# EAGLE design IOTAP (EAGLE 9.6.2)

## Sheet 1 of 3
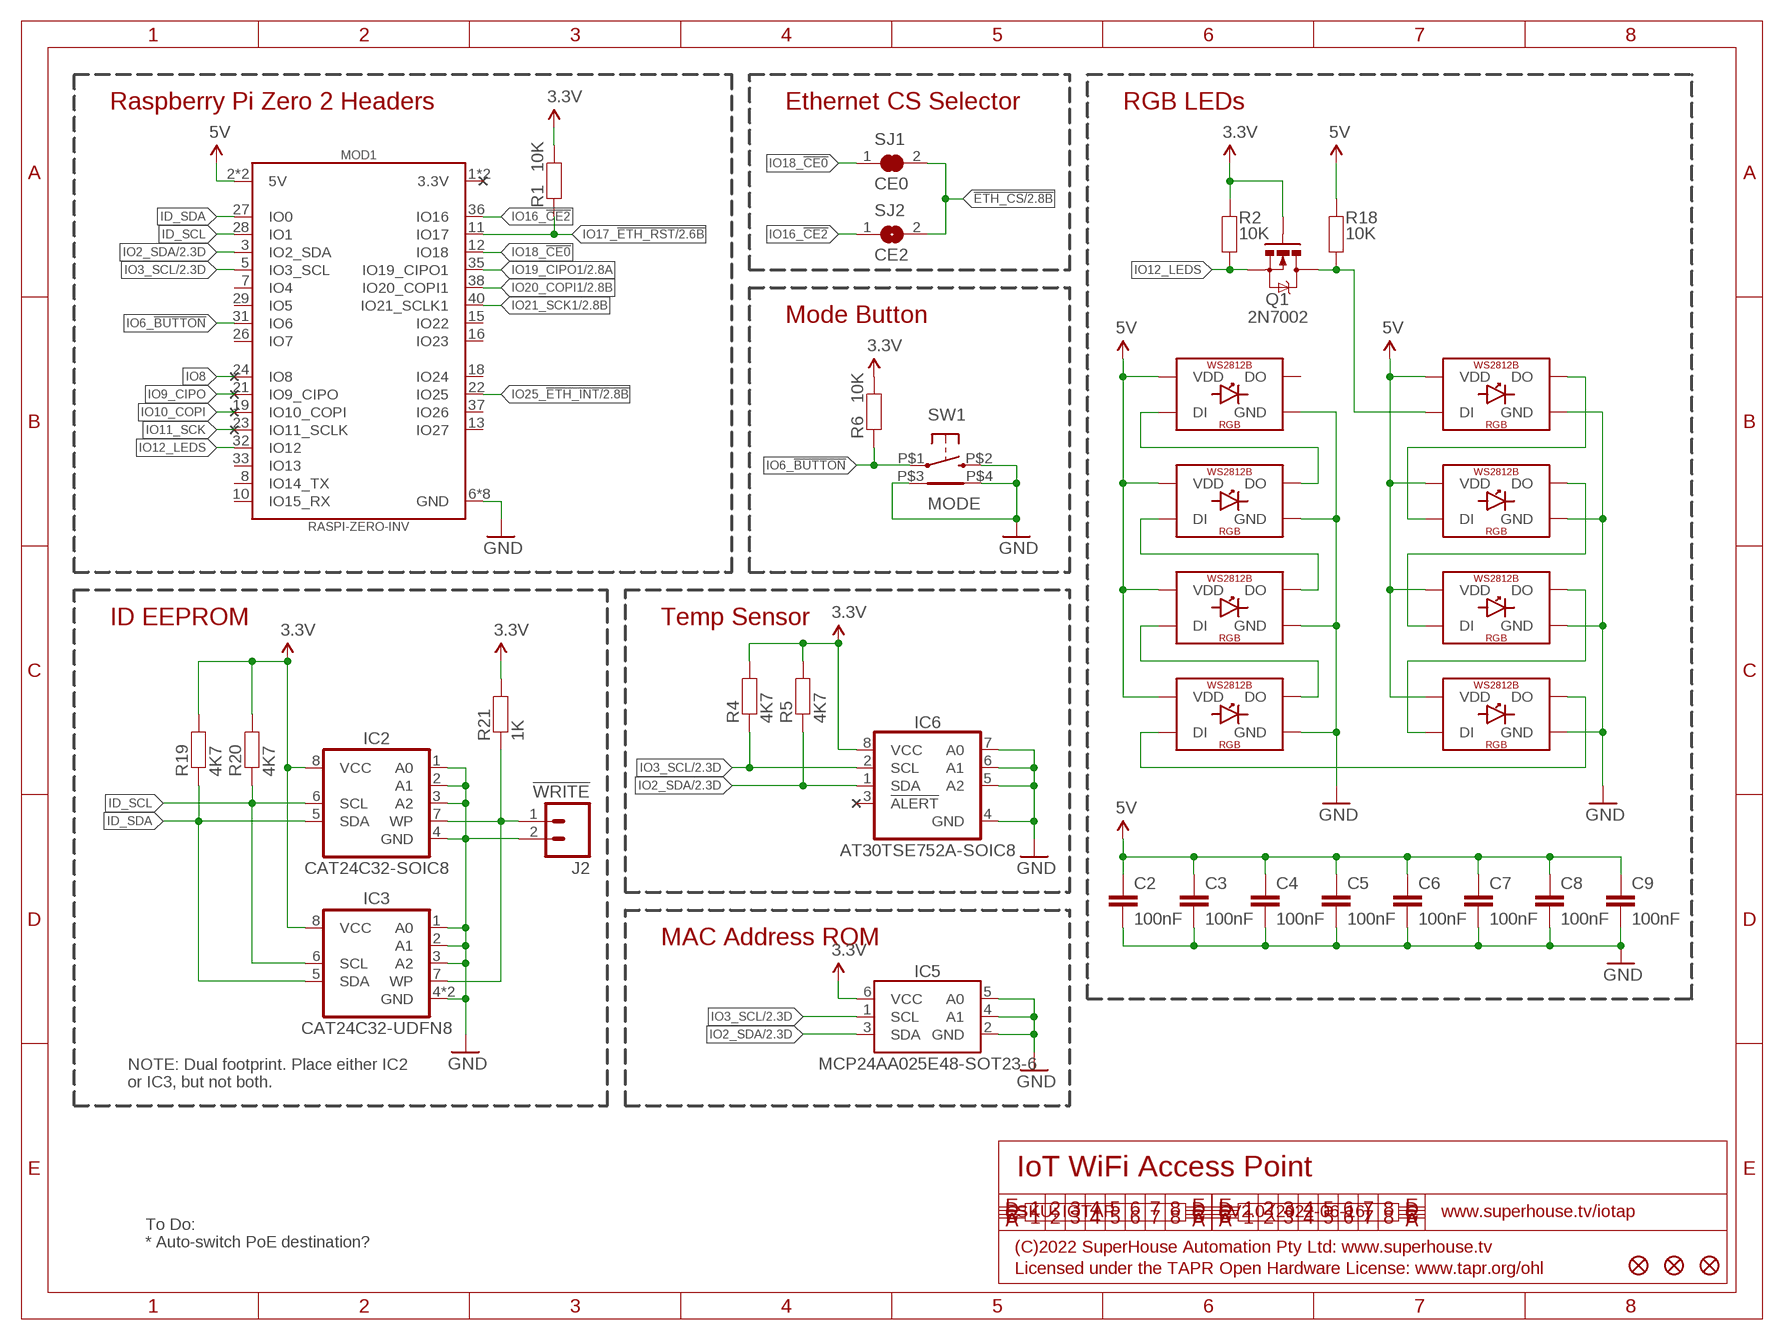
[diagram p0: schematic, sheet 1]

### Parts
C2  100nF  CAP0603  [C0603]
C3  100nF  CAP0603  [C0603]
C4  100nF  CAP0603  [C0603]
C5  100nF  CAP0603  [C0603]
C6  100nF  CAP0603  [C0603]
C7  100nF  CAP0603  [C0603]
C8  100nF  CAP0603  [C0603]
C9  100nF  CAP0603  [C0603]
FID1  FIDUCIAL1X2.5  [FIDUCIAL-1X2.5]
FID2  FIDUCIAL1X2.5  [FIDUCIAL-1X2.5]
FID3  FIDUCIAL1X2.5  [FIDUCIAL-1X2.5]
IC2  CAT24C32-SOIC8  [SOIC8]
IC3  CAT24C32-UDFN8  [UDFN8]
IC5  MCP24AA025E48-SOT23-6  [SOT23-6]
IC6  AT30TSE752A-SOIC8  [SOIC8]
J2  !WRITE  M02-PLAIN  [1X02]
LED1  WS2812B5050  [WS2812B]
LED2  WS2812B5050  [WS2812B]
LED3  WS2812B5050  [WS2812B]
LED4  WS2812B5050  [WS2812B]
LED5  WS2812B5050  [WS2812B]
LED6  WS2812B5050  [WS2812B]
LED7  WS2812B5050  [WS2812B]
LED8  WS2812B5050  [WS2812B]
MOD1  RASPI-ZERO-INV  [RPI-ZERO-INV]
Q1  2N7002  MOSFET-NCHANNEL-233  [SOT23-3]
R1  10K  RESISTOR0603  [R0603]
R2  10K  RESISTOR0603  [R0603]
R4  4K7  RESISTOR0603  [R0603]
R5  4K7  RESISTOR0603  [R0603]
R6  10K  RESISTOR0603  [R0603]
R18  10K  RESISTOR0603  [R0603]
R19  4K7  RESISTOR0603  [R0603]
R20  4K7  RESISTOR0603  [R0603]
R21  1K  RESISTOR0603  [R0603]
SJ1  CE0  SJC-NORMAL  [SJC]
SJ2  CE2  SJ-NORMAL  [SJ]
SW1  MODE  TAC-SWITCH-2PIN-GND-FSMMSHPTR  [TC-120V]

### Nets
3.3V: IC2.8(VCC) IC3.8(VCC) IC5.6(VCC) IC6.8(VCC) Q1.1(G) R1.2 R2.2 R4.2 R5.2 R6.2 R19.2 R20.2 R21.2 ; also sheet 2,3
5V: C2.1 C3.1 C4.1 C5.1 C6.1 C7.1 C8.1 C9.1 LED1.1-VDD(VDD) LED2.1-VDD(VDD) LED3.1-VDD(VDD) LED4.1-VDD(VDD) LED5.1-VDD(VDD) LED6.1-VDD(VDD) LED7.1-VDD(VDD) LED8.1-VDD(VDD) MOD1.2(5V) MOD1.4(5V) R18.2 ; also sheet 3
!ETH_CS: SJ1.2 SJ2.2 ; also sheet 2
GND: C2.2 C3.2 C4.2 C5.2 C6.2 C7.2 C8.2 C9.2 IC2.1(A0) IC2.2(A1) IC2.3(A2) IC2.4(GND) IC3.1(A0) IC3.2(A1) IC3.3(A2) IC3.4(GND) IC3.PAD(GND) IC5.2(GND) IC5.4(A1) IC5.5(A0) IC6.4(GND) IC6.5(A2) IC6.6(A1) IC6.7(A0) J2.2 LED1.3-GND(GND) LED2.3-GND(GND) LED3.3-GND(GND) LED4.3-GND(GND) LED5.3-GND(GND) LED6.3-GND(GND) LED7.3-GND(GND) LED8.3-GND(GND) MOD1.6(GND) MOD1.9(GND) MOD1.14(GND) MOD1.20(GND) MOD1.25(GND) MOD1.30(GND) MOD1.34(GND) MOD1.39(GND) SW1.P$2 SW1.P$3(TAB1) SW1.P$4(TAB2) ; also sheet 2,3
ID_SCL: IC2.6(SCL) IC3.6(SCL) MOD1.28(IO1) R20.1
ID_SDA: IC2.5(SDA) IC3.5(SDA) MOD1.27(IO0) R19.1
IO2_SDA: IC5.3(SDA) IC6.1(SDA) MOD1.3(IO2_SDA) R5.1 ; also sheet 2
IO3_SCL: IC5.1(SCL) IC6.2(SCL) MOD1.5(IO3_SCL) R4.1 ; also sheet 2
IO6_!BUTTON: MOD1.31(IO6) R6.1 SW1.P$1
IO8: MOD1.24(IO8)
IO9_CIPO: MOD1.21(IO9_CIPO)
IO10_COPI: MOD1.19(IO10_COPI)
IO11_SCK: MOD1.23(IO11_SCLK)
IO12_LEDS: MOD1.32(IO12) Q1.2(S) R2.1
IO16_!CE2: MOD1.36(IO16) SJ2.1
IO17_!ETH_RST: MOD1.11(IO17) R1.1 ; also sheet 2
IO18_!CE0: MOD1.12(IO18) SJ1.1
IO19_CIPO1: MOD1.35(IO19_CIPO1) ; also sheet 2
IO20_COPI1: MOD1.38(IO20_COPI1) ; also sheet 2
IO21_SCK1: MOD1.40(IO21_SCLK1) ; also sheet 2
IO25_!ETH_INT: MOD1.22(IO25) ; also sheet 2
LEDS: LED1.4-DIN(DI) Q1.3(D) R18.1
N$5: IC2.7(WP) IC3.7(WP) J2.1 R21.1
N$9: LED4.2-DOUT(DO) LED5.4-DIN(DI)
N$10: LED5.2-DOUT(DO) LED6.4-DIN(DI)
N$11: LED6.2-DOUT(DO) LED7.4-DIN(DI)
N$12: LED7.2-DOUT(DO) LED8.4-DIN(DI)
N$13: LED1.2-DOUT(DO) LED2.4-DIN(DI)
N$14: LED2.2-DOUT(DO) LED3.4-DIN(DI)
N$15: LED3.2-DOUT(DO) LED4.4-DIN(DI)
Unconnected: IC6.3(!ALERT) LED8.2-DOUT(DO) MOD1.1(3.3V) MOD1.7(IO4) MOD1.8(IO14_TX) MOD1.10(IO15_RX) MOD1.13(IO27) MOD1.15(IO22) MOD1.16(IO23) MOD1.17(3.3V) MOD1.18(IO24) MOD1.26(IO7) MOD1.29(IO5) MOD1.33(IO13) MOD1.37(IO26)

### Notes on the sheet
- Raspberry Pi Zero 2 Headers | Ethernet CS Selector | RGB LEDs
- Mode Button
- ID EEPROM | Temp Sensor
- MAC Address ROM
- NOTE: Dual footprint. Place either IC2
  or IC3, but not both.
- IoT WiFi Access Point
- SKU: IOTAP | V2.0 (2022-06-16) | www.superhouse.tv/iotap
- To Do:
  * Auto-switch PoE destination?
- (C)2022 SuperHouse Automation Pty Ltd: www.superhouse.tv
- Licensed under the TAPR Open Hardware License: www.tapr.org/ohl

## Sheet 2 of 3
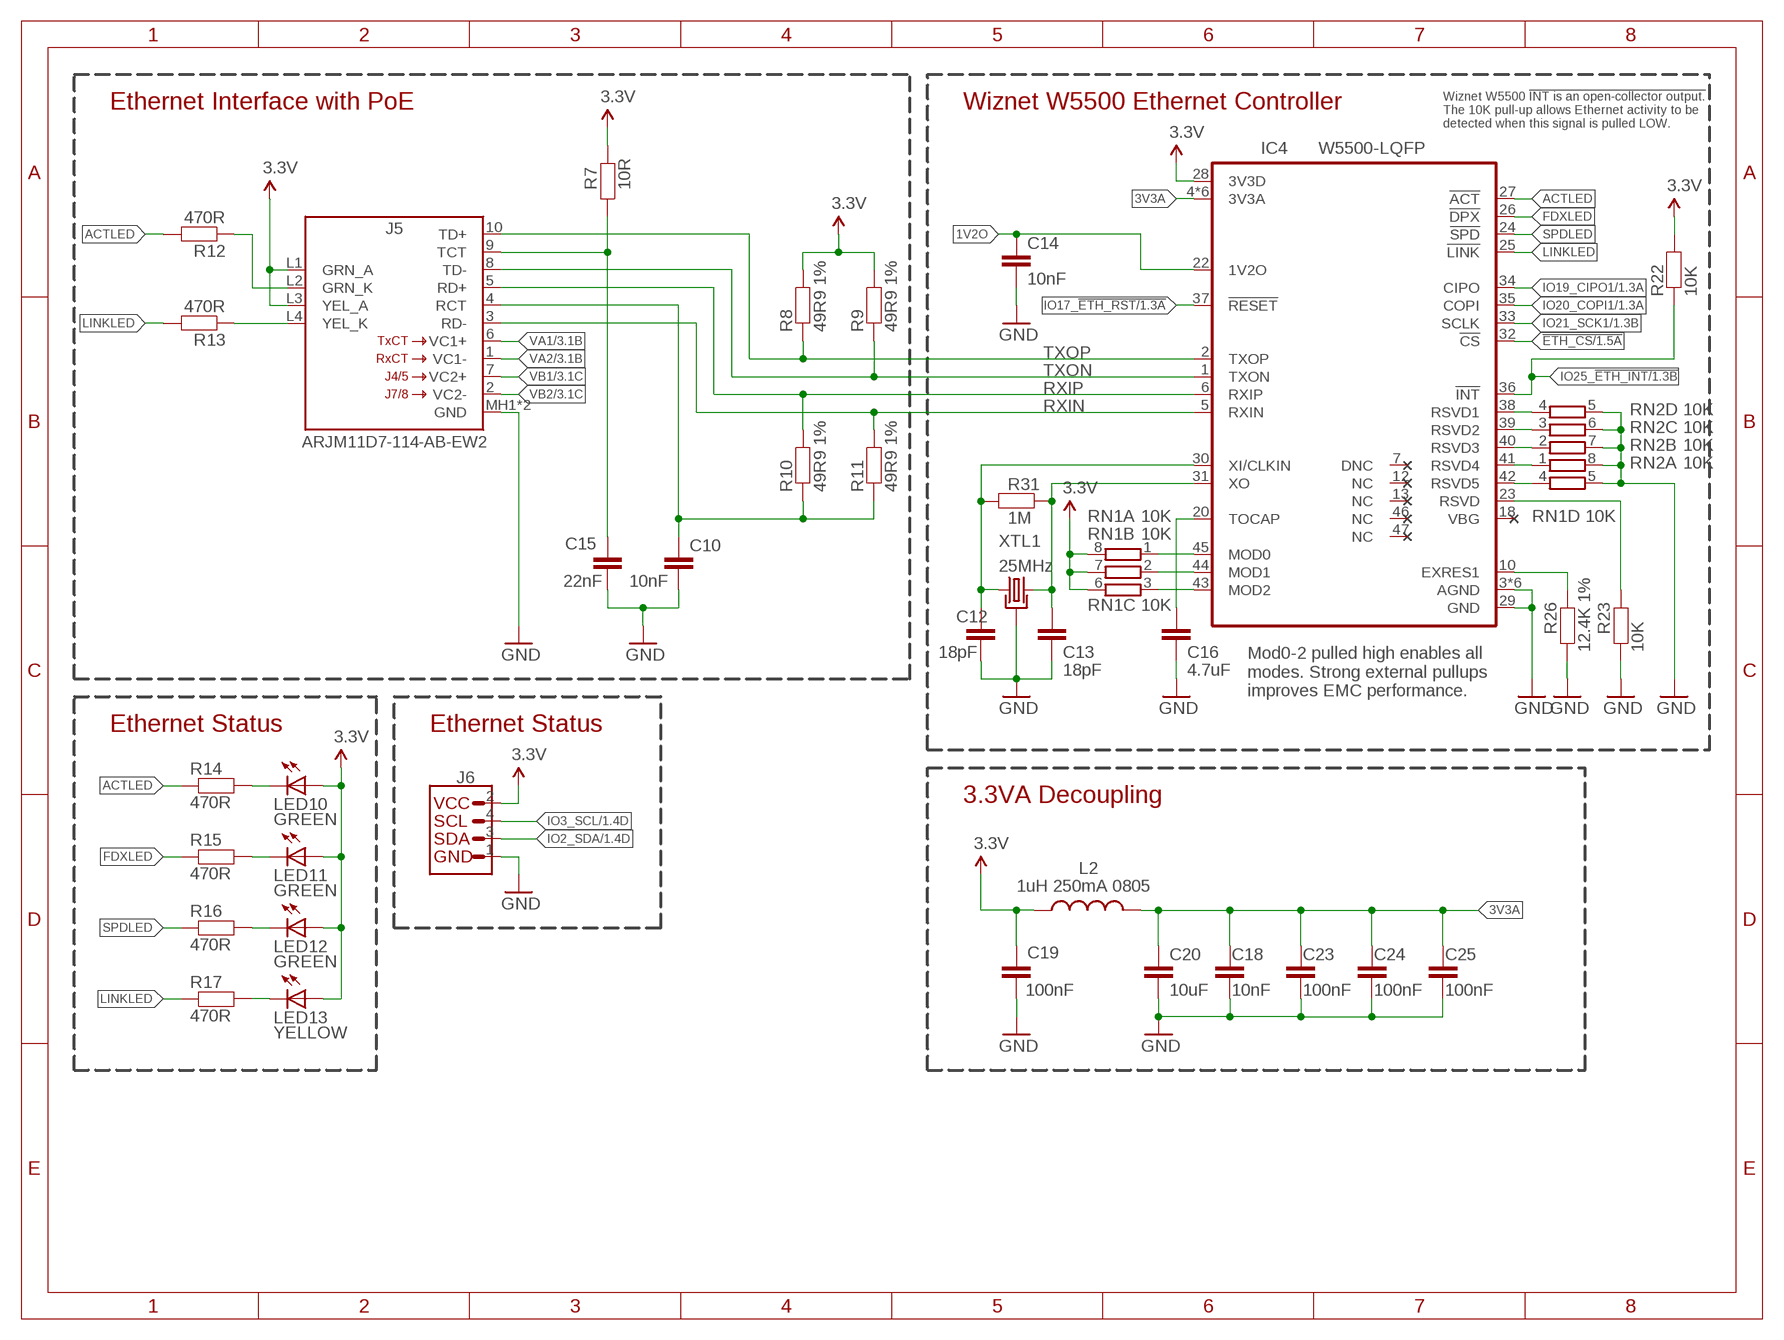
[diagram p1: schematic, sheet 2]

### Parts
C10  10nF  CAP0603  [C0603]
C12  18pF  CAP0603  [C0603]
C13  18pF  CAP0603  [C0603]
C14  10nF  CAP0603  [C0603]
C15  22nF  CAP0603  [C0603]
C16  4.7uF  CAP0603  [C0603]
C18  10nF  CAP0603  [C0603]
C19  100nF  CAP0603  [C0603]
C20  10uF  CAP0805  [C0805]
C23  100nF  CAP0603  [C0603]
C24  100nF  CAP0603  [C0603]
C25  100nF  CAP0603  [C0603]
IC4  W5500-LQFP  [LQFP48]
J5  ARJM11D7-114-AB-EW2  [ARJM11D7114ABEW2]
J6  QWIICJS-1MM  [1X04_QWIIC_1MM_RA]
L2  1uH 250mA 0805  L-USL2012C  [L2012C]
LED10  GREEN  LED0603  [LED-0603]
LED11  GREEN  LED0603  [LED-0603]
LED12  GREEN  LED0603  [LED-0603]
LED13  YELLOW  LED0603  [LED-0603]
R7  10R  RESISTOR0603  [R0603]
R8  49R9 1%  RESISTOR0603  [R0603]
R9  49R9 1%  RESISTOR0603  [R0603]
R10  49R9 1%  RESISTOR0603  [R0603]
R11  49R9 1%  RESISTOR0603  [R0603]
R12  470R  RESISTOR0603  [R0603]
R13  470R  RESISTOR0603  [R0603]
R14  470R  RESISTOR0603  [R0603]
R15  470R  RESISTOR0603  [R0603]
R16  470R  RESISTOR0603  [R0603]
R17  470R  RESISTOR0603  [R0603]
R22  10K  RESISTOR0603  [R0603]
R23  10K  RESISTOR0603  [R0603]
R26  12.4K 1%  RESISTOR0603  [R0603]
R31  1M  RESISTOR0603  [R0603]
RN1  10K  4R-NCAY16  [CAY16]
RN2  10K  4R-NCAY16  [CAY16]
XTL1  25MHz  CRYSTAL-GND3X2  [CRYSTAL-SMD-3X2]

### Nets
1V2O: C14.1 IC4.22(1V2O)
3.3V: C19.1 IC4.28(3V3D) J5.L1(GRN_A) J5.L3(YEL_A) J6.2 L2.1 LED10.A LED11.A LED12.A LED13.A R7.1 R8.2 R9.2 R22.2 RN1.6 RN1.7 RN1.8 ; also sheet 1,3
3V3A: C18.1 C20.1 C23.1 C24.1 C25.1 IC4.4(3V3A) IC4.8(3V3A) IC4.11(3V3A) IC4.15(3V3A) IC4.17(3V3A) IC4.21(3V3A) L2.2
!ETH_CS: IC4.32(!CS) ; also sheet 1
ACTLED: IC4.27(!ACT) R12.2 R14.1
FDXLED: IC4.26(!DPX) R15.1
GND: C10.2 C12.2 C13.2 C14.2 C15.2 C16.2 C18.2 C19.2 C20.2 C23.2 C24.2 C25.2 IC4.3(AGND) IC4.9(AGND) IC4.14(AGND) IC4.16(AGND) IC4.19(AGND) IC4.29(GND) IC4.48(AGND) J5.MH1(GND) J5.MH2(GND) J6.1 R23.2 R26.2 RN1.5 RN2.5 RN2.6 RN2.7 RN2.8 XTL1.2(GND) XTL1.4(GND) ; also sheet 1,3
IO2_SDA: J6.3 ; also sheet 1
IO3_SCL: J6.4 ; also sheet 1
IO17_!ETH_RST: IC4.37(!RESET) ; also sheet 1
IO19_CIPO1: IC4.34(CIPO) ; also sheet 1
IO20_COPI1: IC4.35(COPI) ; also sheet 1
IO21_SCK1: IC4.33(SCLK) ; also sheet 1
IO25_!ETH_INT: IC4.36(!INT) R22.1 ; also sheet 1
LINKLED: IC4.25(!LINK) R13.2 R17.1
N$3: J5.L4(YEL_K) R13.1
N$4: J5.L2(GRN_K) R12.1
N$18: C13.1 IC4.31(XO) R31.1 XTL1.3
N$20: C10.1 J5.4(RCT) R10.1 R11.1
N$26: LED12.C R16.2
N$27: C12.1 IC4.30(XI/CLKIN) R31.2 XTL1.1
N$28: LED13.C R17.2
N$31: C16.1 IC4.20(TOCAP)
N$32: C15.1 J5.9(TCT) R7.2
N$33: IC4.10(EXRES1) R26.1
N$34: IC4.23(RSVD) R23.1
N$36: IC4.45(MOD0) RN1.1
N$37: IC4.44(MOD1) RN1.2
N$38: IC4.43(MOD2) RN1.3
N$39: IC4.42(RSVD5) RN1.4
N$40: IC4.41(RSVD4) RN2.1
N$41: IC4.40(RSVD3) RN2.2
N$42: IC4.39(RSVD2) RN2.3
N$43: IC4.38(RSVD1) RN2.4
N$327: LED11.C R15.2
N$329: LED10.C R14.2
RXIN: IC4.5(RXIN) J5.3(RD-) R11.2
RXIP: IC4.6(RXIP) J5.5(RD+) R10.2
SPDLED: IC4.24(!SPD) R16.1
TXON: IC4.1(TXON) J5.8(TD-) R9.1
TXOP: IC4.2(TXOP) J5.10(TD+) R8.1
VA1: J5.6(VC1+) ; also sheet 3
VA2: J5.1(VC1-) ; also sheet 3
VB1: J5.7(VC2+) ; also sheet 3
VB2: J5.2(VC2-) ; also sheet 3
Unconnected: IC4.7(DNC) IC4.12(NC) IC4.13(NC) IC4.18(VBG) IC4.46(NC) IC4.47(NC)

### Notes on the sheet
- Ethernet Interface with PoE | Wiznet W5500 Ethernet Controller
- Wiznet W5500 !INT is an open-collector output.
  The 10K pull-up allows Ethernet activity to be
  detected when this signal is pulled LOW.
- Mod0-2 pulled high enables all
  modes. Strong external pullups
  improves EMC performance.
- Ethernet Status | Ethernet Status
- 3.3VA Decoupling

## Sheet 3 of 3
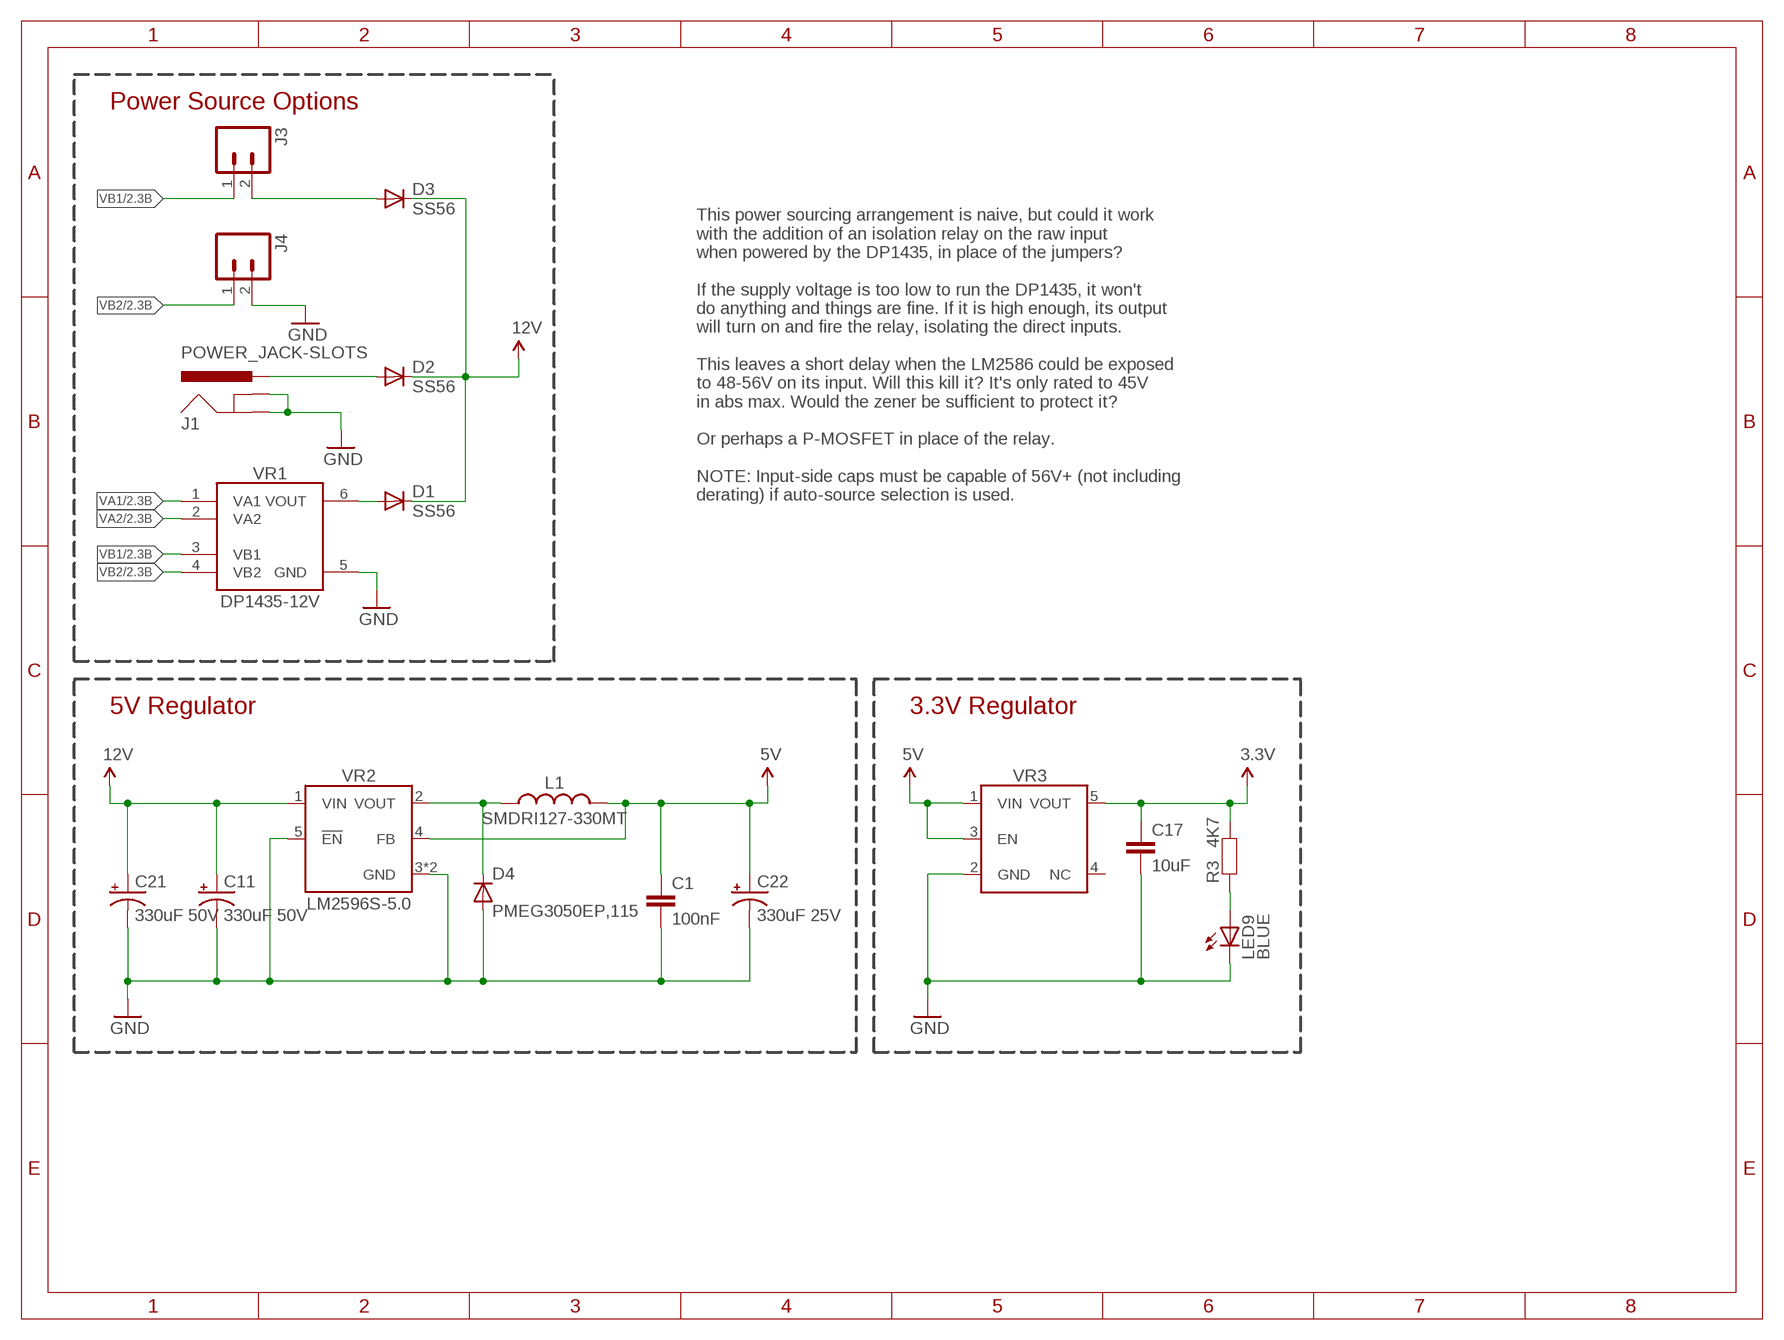
[diagram p2: schematic, sheet 3]

### Parts
C1  100nF  CAP0603  [C0603]
C11  330uF 50V  CAP_POLG  [PANASONIC_G]
C17  10uF  CAP0805  [C0805]
C21  330uF 50V  CAP_POLG  [PANASONIC_G]
C22  330uF 25V  CAP_POLG  [PANASONIC_G]
D1  SS56  DIODESMA  [SMA-DIODE]
D2  SS56  DIODESMA  [SMA-DIODE]
D3  SS56  DIODESMA  [SMA-DIODE]
D4  PMEG3050EP,115  DIODE-SOD128  [SOD-128]
J1  POWER_JACK-SLOTS  [POWER_JACK_SLOTS]
J3  M02-PIN-RA  [1X02-P-RA]
J4  M02-PIN-RA  [1X02-P-RA]
L1  SMDRI127-330MT  INDUCTORCDRH127  [INDPM120120X800N]
LED9  BLUE  LED0603  [LED-0603]
R3  4K7  RESISTOR0603  [R0603]
VR1  DP1435-12V  DP1435-SIL  [DP1435]
VR2  LM2596S-5.0  LM2596S-XX  [TO170P1435X465-6N]
VR3  AP2112KSOT25  [SOT23-5]

### Nets
3.3V: C17.1 R3.2 VR3.5(VOUT) ; also sheet 1,2
5V: C1.1 C22.+ L1.2 VR2.4(FB) VR3.1(VIN) VR3.3(EN) ; also sheet 1
12V: C11.+ C21.+ D1.C D2.C D3.C VR2.1(VIN)
GND: C1.2 C11.- C17.2 C21.- C22.- D4.2(A) J1.GND J1.GNDBREAK J4.2 LED9.C VR1.5(GND) VR2.3(GND) VR2.5(!EN) VR2.6(GND) VR3.2(GND) ; also sheet 1,2
N$1: D3.A J3.2
N$2: D4.1(C) L1.1 VR2.2(VOUT)
N$16: LED9.A R3.1
N$17: D2.A J1.PWR
N$19: D1.A VR1.6(VOUT)
VA1: VR1.1(VA1) ; also sheet 2
VA2: VR1.2(VA2) ; also sheet 2
VB1: J3.1 VR1.3(VB1) ; also sheet 2
VB2: J4.1 VR1.4(VB2) ; also sheet 2
Unconnected: VR3.4(NC)

### Notes on the sheet
- Power Source Options
- This power sourcing arrangement is naive, but could it work
  with the addition of an isolation relay on the raw input
  when powered by the DP1435, in place of the jumpers?
  
  If the supply voltage is too low to run the DP1435, it won't
  do anything and things are fine. If it is high enough, its output
  will turn on and fire the relay, isolating the direct inputs.
  
  This leaves a short delay when the LM2586 could be exposed
  to 48-56V on its input. Will this kill it? It's only rated to 45V
  in abs max. Would the zener be sufficient to protect it?
  
  Or perhaps a P-MOSFET in place of the relay.
  
  NOTE: Input-side caps must be capable of 56V+ (not including
  derating) if auto-source selection is used.
- 5V Regulator | 3.3V Regulator

## Library data of the parts
C1-C10 C12-C20 C23-C25 = SuperHouse-Capacitors:CAP: Capacitor Standard ceramic capacitor
C11 C21 C22 = SuperHouse-Capacitors:CAP_POL: Capacitor Polarized These are standard SMD and PTH capacitors. Normally 10uF, 47uF, and 100uF in electrolytic and tantalum varieties. Always verify the external diameter of the through hole cap, it varies with capacity, voltage, and manufacturer. The EIA devices should be standard.
D1-D4 = SuperHouse-Diodes:DIODE: Diode Standard reverse protection diodes and small signal diodes. SMA package can handle up to about 1A. SOD-323 can handle about 200mA.
FID1-FID3 = SuperHouse-Symbols:FIDUCIAL: Fiducial Alignment Points Various fiducial points for machine vision alignment.
IC2 IC3 = SuperHouse-ICs:CAT24C32
IC4 = SuperHouse-ICs:W5500
IC5 = SuperHouse-ICs:MCP24AA025E48: MAC address ROM with I2C interface
IC6 = SuperHouse-Sensors:AT30TSE752A: AT30TSE752A I2C temperature sensor with EEPROM
J1 = SuperHouse-Connectors:POWER_JACK: Power Jack This is the standard 5.5mm barrel jack for power. The PTH is the most common, proven, reliable, footprint. All others are experimental. The Slot footprint only works if the mill layer is transmitted to the PCB fab house so be warned. Spark Fun Electronics SKU : PRT-00119. Mating wall wart : TOL-00298 (and others)
J2-J4 = SuperHouse-Connectors:M02: 2-way header Standard 1x2 header, and screw terminal variations
J5 = SuperHouse-Connectors:ARJM11D7-114-AB-EW2: Modular Connectors / Ethernet Connectors Source: Datasheet; DESCRIPTION: Modular Connectors / Ethernet Connectors; HEIGHT: 13.6mm; MANUFACTURER_NAME: ABRACON; MANUFACTURER_PART_NUMBER: ARJM11D7-114-AB-EW2; MOUSER_PART_NUMBER: 815-RJM11D7114ABEW2; MOUSER_PRICE-STOCK: https://www.mouser.co.uk/ProductDetail/ABRACON/ARJM11D7-114-AB-EW2?qs=YCa%2FAAYMW02ICsJcHu%252BNJg%3D%3D
J6 = SuperHouse-Connectors:QWIIC: SparkFun I2C Standard Qwiic Connector An SMD 1mm pitch JST connector makes it easy and quick (get it? Qwiic?) to connect I2C devices to each other. The Qwiic system <http://www.sparkfun.com/qwiic> enables fast and solderless connection between popular platforms and various sensors and actuators.; PROD_ID: CONN-13694
L1 = SuperHouse-Inductors:INDUCTOR: INDUCTOR, American symbol
L2 = rcl:L-US: INDUCTOR, American symbol; SPICEPREFIX: L
LED1-LED8 = SuperHouse-LEDs:WS2812B: WS2812B addressable RGB LED
LED9-LED13 = SuperHouse-LEDs:LED: LEDs in various sizes including 5mm and 3mm PTH, and 0402, 0603, 0805, etc SMT
MOD1 = SuperHouse-Modules:RASPI
Q1 = SuperHouse-Transistors:MOSFET-NCHANNEL: N-channel MOSFET
R1-R23 R26 R31 = SuperHouse-Resistors:RESISTOR: Resistors in both surface-mount and through-hole versions.
RN1 RN2 = SuperHouse-Resistors:4R-N: Array Chip Resistor Source: RS Component / Phycomp
SJ1 = SuperHouse-Jumpers:SJC: Solder jumper. Normally closed: does not need solder to close. Can be opened by cutting the track.
SJ2 = SuperHouse-Jumpers:SJ: SMD solder jumper, normally-open. Add solder to close the connection.
SW1 = SuperHouse-Switches:TAC-SWITCH-2PIN-GND: Tactile switch (right angle) with 2 mounting tabs
VR1 = SuperHouse-Regulators:DP1435: SDAPO DP1435 12V PoE regulator
VR2 = SuperHouse-Regulators:LM2596S-XX: 4.5V to 40V, 3A Low Component Count Step-Down Regulator Source: Datasheet <http://www.ti.com/lit/ds/symlink/lm2596.pdf>
VR3 = SuperHouse-Regulators:AP2112K: AP2112K LDO linear voltage regulator
XTL1 = SuperHouse-Oscillators:CRYSTAL-GND: 3x2mm SMT crystal

## Net classes
0 default: width 0.152 mm, drill 0.241 mm, clearance 0.152 mm

## Board
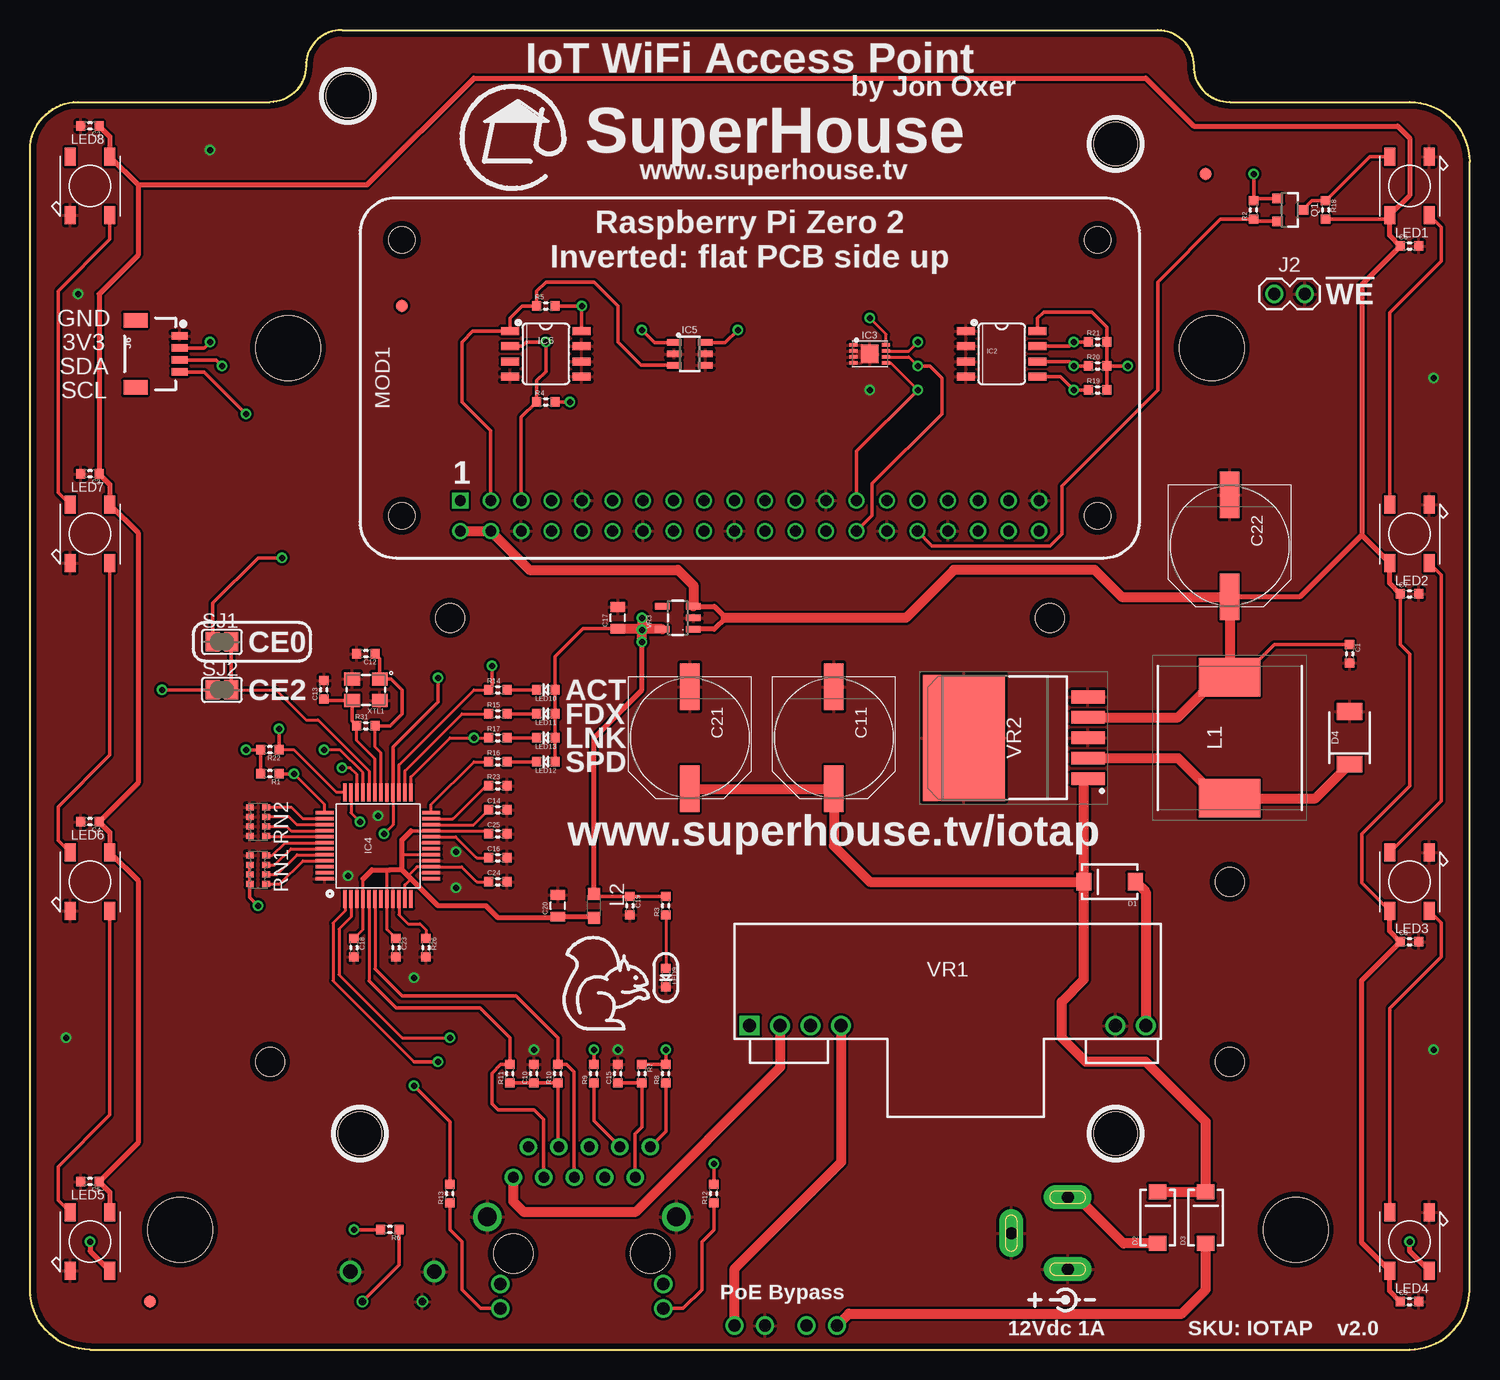
[diagram p3: board, top side]
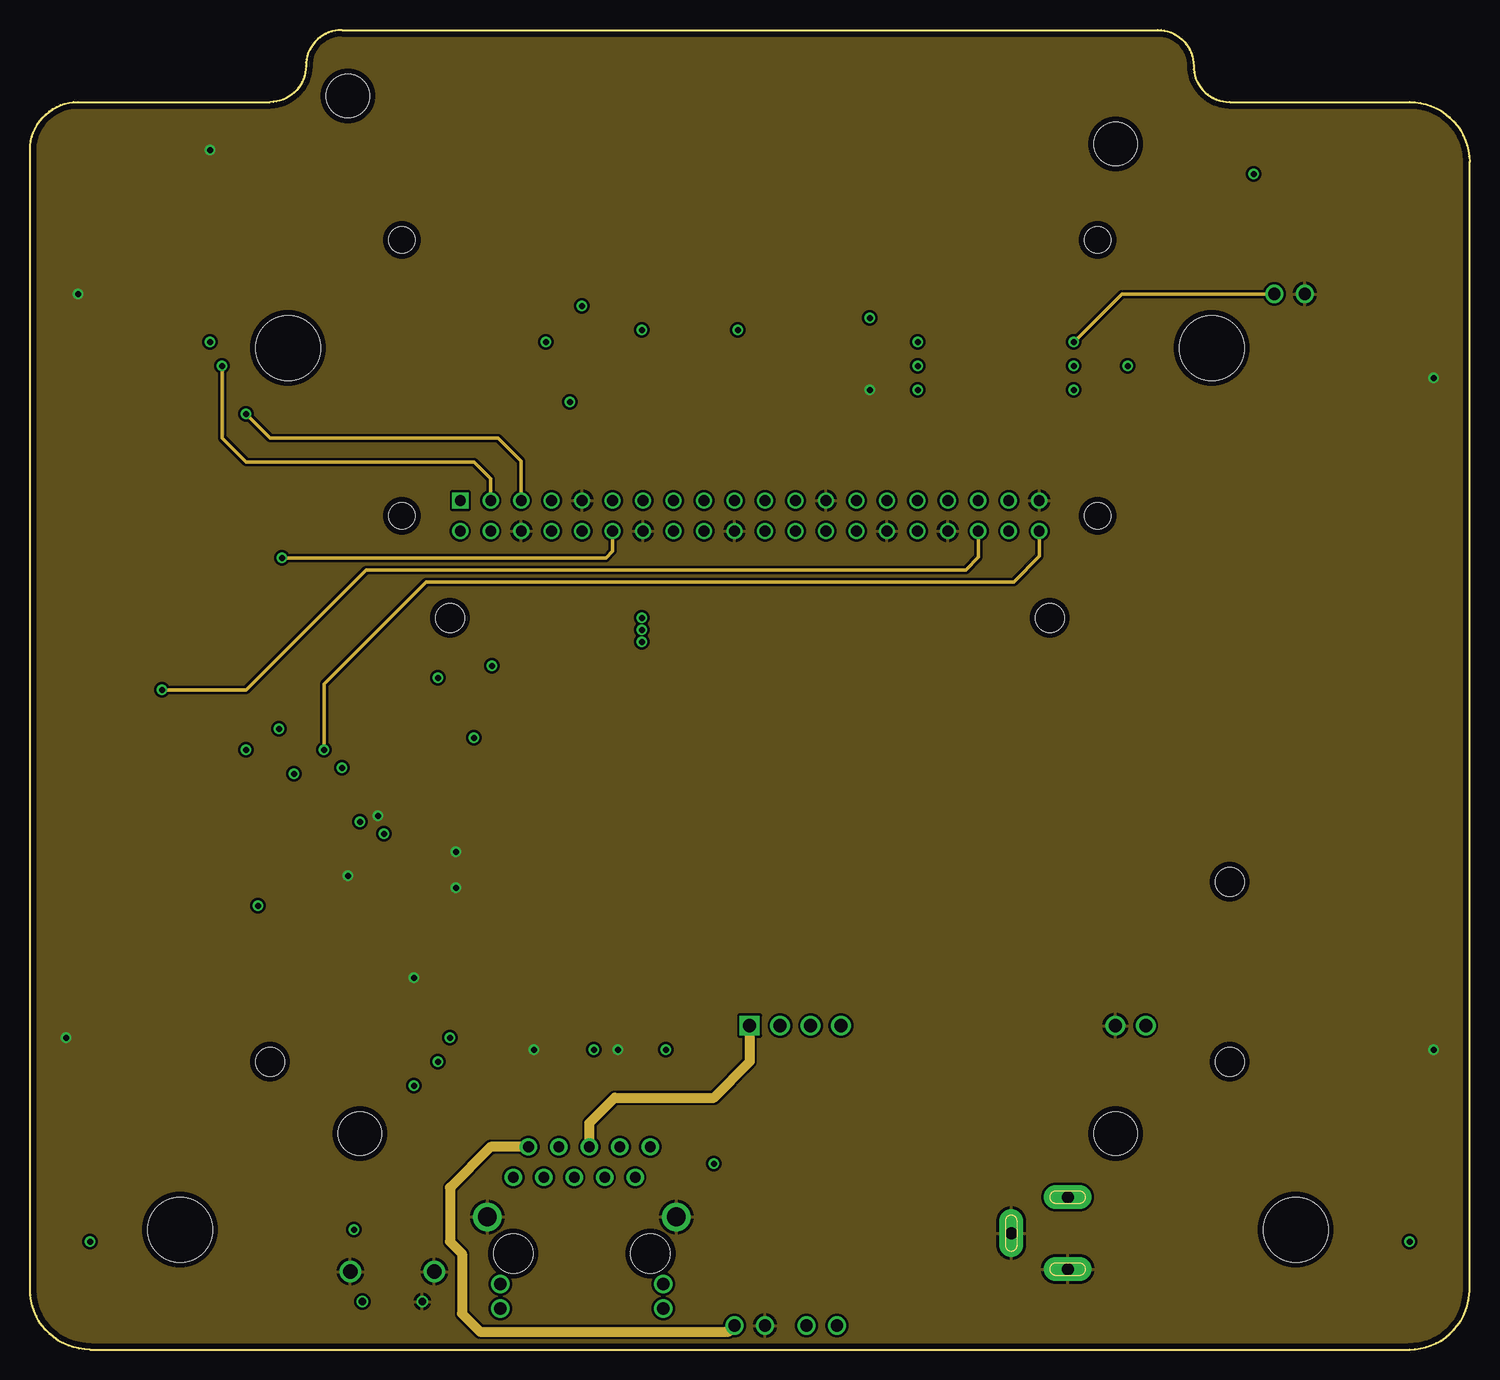
[diagram p4: board, inner layer Route2]
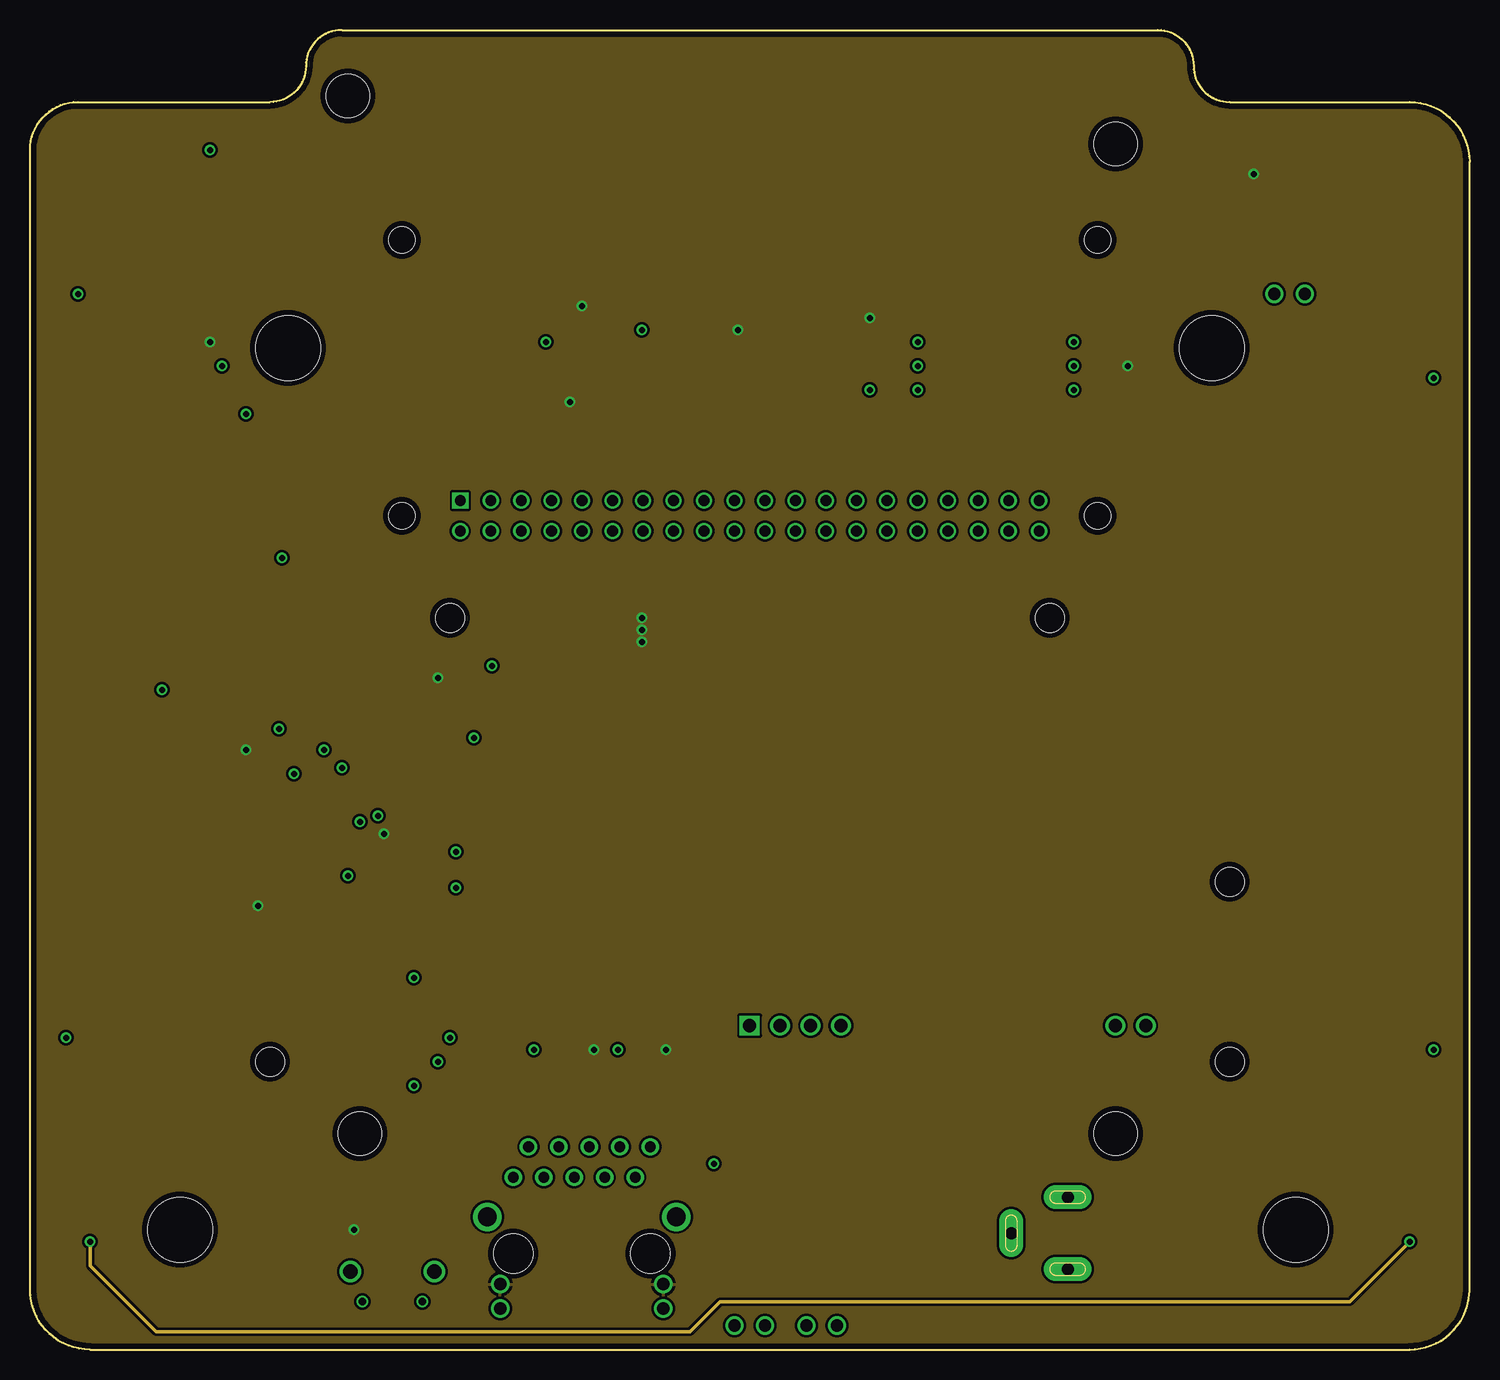
[diagram p5: board, inner layer Route15]
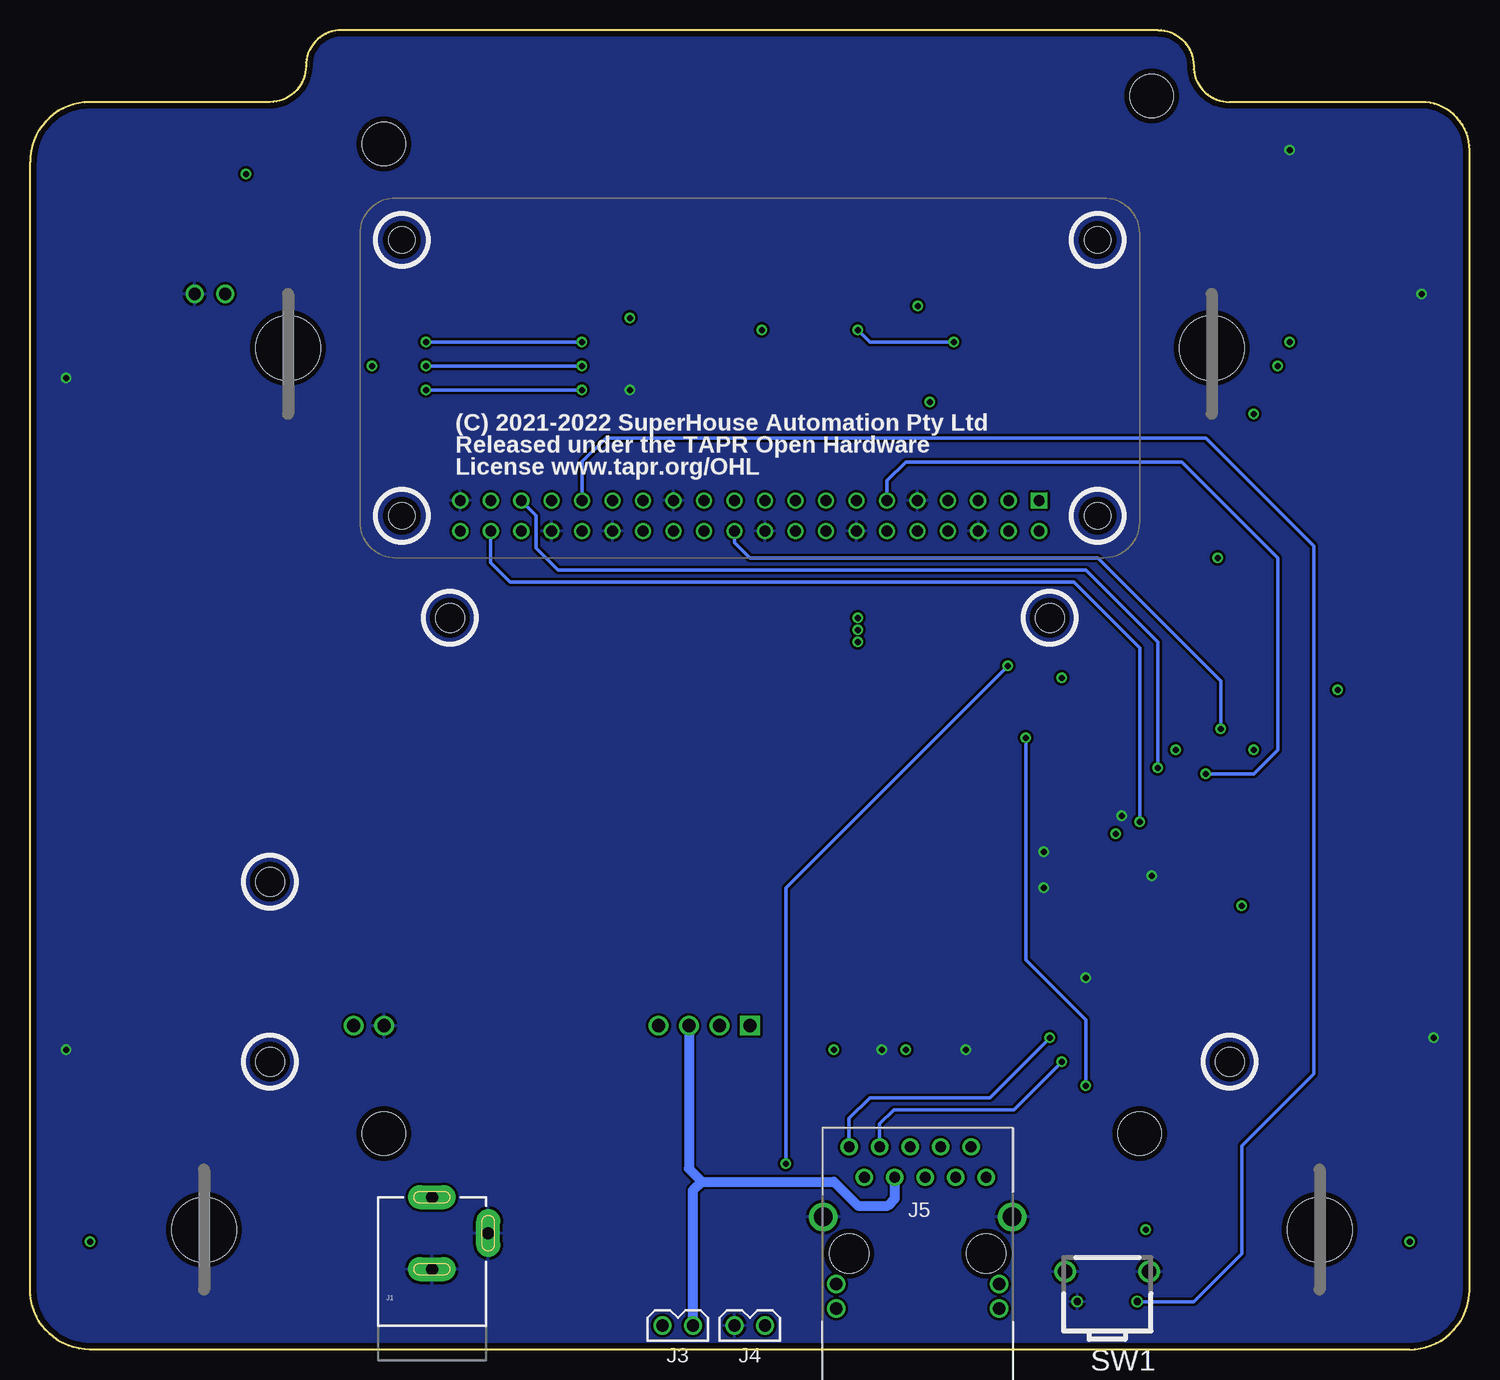
[diagram p6: board, bottom side, seen from below]

Size 120 x 110 mm. Coordinates in mm from the lower left corner, seen from the top.
Outline: 5,0 115,0 arc90 120,5 120,99 arc90 115,104 100,104 arc-90 97,107 arc90 94,110 26,110 arc90 23,107 arc-90 20,104 4,104 arc90 0,100 0,5 arc90 5,0
Copper layers (1+2*15+16): Top 0.035mm / dielectric 1.5mm / Route2 0.035mm / dielectric 0.15mm / Route15 0.035mm / dielectric 0.2mm / Bottom 0.035mm
Design rules "SuperHouse-Design-Rules *": minimum track width 10mil, minimum drill 24mil, track to track 8mil, track to pad 8mil, pad to pad 8mil, via to via 8mil, smd to smd 6mil, copper to edge 18mil, drill to drill 8mil, minimum pad ring 7mil, minimum via ring 8mil, stop-mask expansion 4mil, vias tented up to drill 0.5mm, thermal gap 10mil
Holes 5.4 mm at 105.5,10 12.5,10 21.5,83.5 98.5,83.5
Holes 3.6 mm at 27.5,18 90.5,18 26.5,104.5 90.5,100.5
Holes 2.4 mm at 85,61 35,61 100,39 100,24 20,24

### Footprints (pad centres in the part's own frame; a part is rotated, then mirrored left to right if it is on the bottom)
C0603 = smd 0.762 x 0.762: 1 -0.762,0; 2 0.762,0
PANASONIC_G = smd 3.9 x 1.6: + 4.25,0; - -4.25,0
C0805 = smd 0.8 x 1.2: 1 -0.9,0; 2 0.9,0
SMA-DIODE = smd 1.27 x 1.47: A -2.15,0; C 2.15,0
SOD-128 = smd 1.4 x 2.1: 1 -2.2,0; 2 2.2,0
FIDUCIAL-1X2.5 = smd 1 x 1: 1 0,0
SOIC8 = smd 1.524 x 0.66: 1 -2.973,1.905; 2 -2.973,0.635; 3 -2.973,-0.635; 4 -2.973,-1.905; 5 2.973,-1.905; 6 2.973,-0.635; 7 2.973,0.635; 8 2.973,1.905
UDFN8 = smd 0.68 x 0.3: 1 -1.36,0.75; 2 -1.36,0.25; 3 -1.36,-0.25; 4 -1.36,-0.75; 5 1.36,-0.75; 6 1.36,-0.25; 7 1.36,0.25; 8 1.36,0.75 | smd 1.45 x 1.56: PAD 0,0
LQFP48 = smd 1.5 x 0.3: 1 -4.45,2.75; 2 -4.45,2.25; 3 -4.45,1.75; 4 -4.45,1.25; 5 -4.45,0.75; 6 -4.45,0.25; 7 -4.45,-0.25; 8 -4.45,-0.75; 9 -4.45,-1.25; 10 -4.45,-1.75; 11 -4.45,-2.25; 12 -4.45,-2.75; 25 4.45,-2.75; 26 4.45,-2.25; 27 4.45,-1.75; 28 4.45,-1.25; 29 4.45,-0.75; 30 4.45,-0.25; 31 4.45,0.25; 32 4.45,0.75; 33 4.45,1.25; 34 4.45,1.75; 35 4.45,2.25; 36 4.45,2.75 | smd 0.3 x 1.5: 13 -2.75,-4.45; 14 -2.25,-4.45; 15 -1.75,-4.45; 16 -1.25,-4.45; 17 -0.75,-4.45; 18 -0.25,-4.45; 19 0.25,-4.45; 20 0.75,-4.45; 21 1.25,-4.45; 22 1.75,-4.45; 23 2.25,-4.45; 24 2.75,-4.45; 37 2.75,4.45; 38 2.25,4.45; 39 1.75,4.45; 40 1.25,4.45; 41 0.75,4.45; 42 0.25,4.45; 43 -0.25,4.45; 44 -0.75,4.45; 45 -1.25,4.45; 46 -1.75,4.45; 47 -2.25,4.45; 48 -2.75,4.45
SOT23-6 = smd 1.2 x 0.55: 1 -1.3,0.95; 2 -1.3,0; 3 -1.3,-0.95; 4 1.3,-0.95; 5 1.3,0; 6 1.3,0.95
POWER_JACK_SLOTS = drill 1 pad 2 long: GND 0,7.7; GNDBREAK 4.7,10.7; PWR 0,13.7
1X02 = drill 1.016: 1 -1.27,0; 2 1.27,0
1X02-P-RA = drill 1.016: 1 -1.27,0; 2 1.27,0
ARJM11D7114ABEW2 = drill 0.89 pad 1.446: 1 5.715,6.35; 2 4.445,8.89; 3 3.175,6.35; 4 1.905,8.89; 5 0.635,6.35; 6 -0.635,8.89; 7 -1.905,6.35; 8 -3.175,8.89; 9 -4.445,6.35; 10 -5.715,8.89 | drill 1.02 pad 1.53: L1 -6.8,-2.55; L2 -6.8,-4.58; L3 6.8,-2.55; L4 6.8,-4.58 | drill 1.57 pad 2.355: MH1 7.875,3.05; MH2 -7.875,3.05 | hole 3.25: 5.715,0; -5.715,0
1X04_QWIIC_1MM_RA = smd 0.6 x 1.35: 1 -1.5,2.475; 2 -0.5,2.475; 3 0.5,2.475; 4 1.5,2.475 | smd 1.2 x 2: NC1 2.8,-1.2; NC2 -2.8,-1.2
INDPM120120X800N = smd 3.2 x 5.1: 1 -5.05,0; 2 5.05,0
L2012C = smd 1 x 1: 1 -1,0; 2 1,0
WS2812B = smd 1.5 x 0.9: 1-VDD 2.45,-1.65; 2-DOUT 2.45,1.65; 3-GND -2.45,1.65; 4-DIN -2.45,-1.65
LED-0603 = smd 0.762 x 0.762: A -0.762,0; C 0.762,0
RPI-ZERO-INV = drill 0.9 square: 1 -10.23,24.13 | drill 0.9: 2 -12.77,24.13; 3 -10.23,21.59; 4 -12.77,21.59; 5 -10.23,19.05; 6 -12.77,19.05; 7 -10.23,16.51; 8 -12.77,16.51; 9 -10.23,13.97; 10 -12.77,13.97; 11 -10.23,11.43; 12 -12.77,11.43; 13 -10.23,8.89; 14 -12.77,8.89; 15 -10.23,6.35; 16 -12.77,6.35; 17 -10.23,3.81; 18 -12.77,3.81; 19 -10.23,1.27; 20 -12.77,1.27; 21 -10.23,-1.27; 22 -12.77,-1.27; 23 -10.23,-3.81; 24 -12.77,-3.81; 25 -10.23,-6.35; 26 -12.77,-6.35; 27 -10.23,-8.89; 28 -12.77,-8.89; 29 -10.23,-11.43; 30 -12.77,-11.43; 31 -10.23,-13.97; 32 -12.77,-13.97; 33 -10.23,-16.51; 34 -12.77,-16.51; 35 -10.23,-19.05; 36 -12.77,-19.05; 37 -10.23,-21.59; 38 -12.77,-21.59; 39 -10.23,-24.13; 40 -12.77,-24.13 | hole 2.2: -11.5,29; 11.5,29; 11.5,-29; -11.5,-29
SOT23-3 = smd 0.8 x 0.9: 1 -0.95,-1; 2 0.95,-1; 3 0,1.1
R0603 = smd 0.762 x 0.762: 1 -0.762,0; 2 0.762,0
CAY16 = smd 0.5 x 0.65: 1 -1.2,-0.675; 2 -0.4,-0.675; 3 0.4,-0.675; 4 1.2,-0.675; 5 1.2,0.675; 6 0.4,0.675; 7 -0.4,0.675; 8 -1.2,0.675
SJC = smd 1.168 x 1.6: 1 -0.762,0; 2 0.762,0
SJ = smd 1.168 x 1.6: 1 -0.762,0; 2 0.762,0
TC-120V = drill 0.6: P$1 -2.5,0; P$2 2.5,0 | drill 1.2: P$3 -3.5,-2.5; P$4 3.5,-2.5
DP1435 = drill 1.1 square: 1 -16.51,0 | drill 1.1: 2 -13.97,0; 3 -11.43,0; 4 -8.89,0; 5 13.97,0; 6 16.51,0
TO170P1435X465-6N = smd 1.05 x 2.8: 1 -3.4,-6.2; 2 -1.7,-6.2; 3 0,-6.2; 4 1.7,-6.2; 5 3.4,-6.2 | smd 10.5 x 6.85: 6 0,4.15
SOT23-5 = smd 0.55 x 1.2: 1 -0.95,-1.3; 2 0,-1.3; 3 0.95,-1.3; 4 0.95,1.3; 5 -0.95,1.3
CRYSTAL-SMD-3X2 = smd 1.3 x 1.1: 1 -1.15,-0.9; 2 1.15,-0.9; 3 1.15,0.9; 4 -1.15,0.9

### Placement (x,y rotation side)
C1  110,58 270 top
C2  5,102 180 top
C3  5,73 180 top
C4  5,44 180 top
C5  5,14 180 top
C6  115,92 0 top
C7  115,63 0 top
C8  115,34 0 top
C9  115,4 0 top
C10  42,23 90 top
C11  67,51 270 top
C12  28,58 180 top
C13  24.5,55 90 top
C14  39,45 0 top
C15  49,23 90 top
C16  39,41 0 top
C17  49,61 90 top
C18  27,33.5 270 top
C19  50,37 270 top
C20  44,37 90 top
C21  55,51 270 top
C22  100,67 270 top
C23  30.5,33.5 270 top
C24  39,39 0 top
C25  39,43 0 top
D1  90,39 180 top
D2  94,11 90 top
D3  98,11 90 top
D4  110,51 90 top
FID1  10,4 0 top
FID2  98,98 0 top
FID3  31,87 0 top
IC2  81,83 0 top
IC3  70,83 0 top
IC4  29,42 90 top
IC5  55,83 0 top
IC6  43,83 0 top
J1  86.5,-1 0 bottom
J2  105,88 0 top
J3  66,2 180 bottom
J4  60,2 180 bottom
J5  46,8 0 bottom
J6  10,83 270 top
L1  100,51 90 top
L2  47,37 270 top
LED1  115,97 270 top
LED2  115,68 270 top
LED3  115,39 270 top
LED4  115,9 270 top
LED5  5,9 90 top
LED6  5,39 90 top
LED7  5,68 90 top
LED8  5,97 90 top
LED9  53,31 270 top
LED10  43,55 180 top
LED11  43,53 180 top
LED12  43,49 180 top
LED13  43,51 180 top
MOD1  60,81 90 top
Q1  105,95 270 top
R1  20,48 180 top
R2  102,95 90 top
R3  53,37 90 top
R4  43,79 0 top
R5  43,87 0 top
R6  30,10 180 top
R7  51,23 270 top
R8  53,23 90 top
R9  47,23 90 top
R10  44,23 90 top
R11  40,23 90 top
R12  57,13 90 top
R13  35,13 90 top
R14  39,55 0 top
R15  39,53 0 top
R16  39,49 0 top
R17  39,51 0 top
R18  108,95 270 top
R19  89,80 0 top
R20  89,82 0 top
R21  89,84 0 top
R22  20,50 180 top
R23  39,47 0 top
R26  33,33.5 270 top
R31  28,52 0 top
RN1  19,40 90 top
RN2  19,44 90 top
SJ1  16,59 0 top
SJ2  16,55 0 top
SW1  30.2,4 180 bottom
VR1  76.5,27 0 top
VR2  82,51 90 top
VR3  54,61 90 top
XTL1  28,55 180 top

### Tracks (layer width: path | path; a pad name or v marks a point on that pad's centre or on a via)
1V2O
  Top 0.254: IC4.22 36.99,43.75 C14.1
3.3V  (via drill 0.5)
  Top 0.254: IC4.28 30.25,43.75 v29.5,43 | IC3.8 71.36,84.64 v70,86
  Top 0.305: RN1.6 RN1.7 RN1.8 18.32,37.67 v19,37 | R1.2 R22.2 v18,50 | LED12.A LED13.A LED11.A LED10.A 43.76,57.76 46.1,60.1 C17.1 | Q1.1 102.19,95.95 R2.2 v102,98 | R7.1 R8.2 v53,25 | IC4.28 30.25,50.25 34,54 v34,56 | L2.1 47.24,37.76 C19.1 R3.2 | R20.2 R21.2 89.76,85.24 88.5,86.5 84.5,86.5 83.97,85.97 IC2.8 | R20.2 R19.2 | R20.2 v91.5,82 | R9.2 v47,25 | R5.2 v46,87 45.97,86.97 IC6.8 | R4.2 v45,79 | IC5.6 57.95,83.95 v59,85 | J6.2 14.5,83.5 v15,84 | R6.2 v27,10
  Top 0.406: v51,59 51,55 47,51 L2.1
  Top 0.813: v51,61 v51,60 | VR3.5 51.05,60.05 | 51.05,60.05 v51,60 | v51,59 v51,60 | C17.1 51,60.1 51.05,60.05
  pour Route15: 0,0 0,110 120,110 120,0
3V3A
  Top 0.254: 32.25,43.25 IC4.21 37.99,43.25 C25.1 | C24.1 37.24,39 35.99,40.25 IC4.15 32.25,40.25 31.5,39.5 | C18.1 27.75,35.01 IC4.4 27.75,39.25 | C23.1 29.75,35.01 IC4.8 29.75,40 30,40 | IC4.11 31.25,38.75 31.75,39.25 | IC4.17 31,41.25 31,41.5
  Top 0.305: 46.9,36.1 L2.2 | C20.1 43.9,36 | 31.75,43.25 32.25,43.25
  Top 0.406: C20.1 46.9,36.1 | 43.9,36 39,36 38,37 34,37 31.75,39.25 31.5,39.5 31,40 | 31,40 31,41.5 31,42.5 31.75,43.25 | 31,40 30,40 28.5,40 27.75,39.25
5V
  Top 0.305: R18.2 113.04,94.24 LED1.1-VDD | C1.1 103.71,58.76 101,56.05 L1.2 | LED3.1-VDD 111,38.9 111,43 115,47 115,58 114.24,58.76 C7.1
  Top 0.406: 9,97.1 LED8.1-VDD 6.65,101.11 C2.1 | LED5.1-VDD 6.65,13.11 C5.1 9,17.24 9,39.1 LED6.1-VDD 6.65,43.11 C4.1 9,47.24 9,68.1 LED7.1-VDD 6.65,72.11 C3.1 5.76,88 9,91.24 9,97.1 | C9.1 113.35,4.89 LED4.1-VDD 111,8.9 111,30.76 C8.1 113.35,34.89 LED3.1-VDD | C7.1 113.35,63.89 LED2.1-VDD 111,67.9 | 9,97.1 28.1,97.1 37,106 93,106 97,102 114,102 115,101 115,96.2 LED1.1-VDD 113.35,92.89 C6.1 111,88.76 111,67.9 | 111,67.9 105.85,62.75 C22.+ | VR3.3 57.05,61.95 58,61 57.05,60.05 VR3.1
  Top 0.813: MOD1.2 MOD1.4 41.64,65 54,65 55.3,63.7 VR3.3 | VR2.4 95.7,52.7 99.05,56.05 L1.2 C22.+ 91,62.75 88.75,65 77,65 73,61 58,61
12V
  Top 0.813: D2.C D3.C 98,19 93,24 88,24 86,26 86,29 87.85,30.85 D1.C | D1.C 87.85,47.25 VR2.1 | C21.+ C11.+ 67,42 70,39 D1.C
!ETH_CS
  Top 0.254: SJ2.2 20.5,55 23,52.5 24,52.5 28.25,48.25 IC4.32
  Top 0.305: SJ2.2 16.76,58.46 17.07,58.77 17.07,59 SJ1.2
ACTLED  (via drill 0.5)
  Top 0.254: IC4.27 30.75,48.75 37,55 R14.1
  Top 0.305: R12.2 v57,15.5 | v38.5,57 38.5,55.26 R14.1
  Bottom 0.305: v57,15.5 57,38.5 v38.5,57
FDXLED
  Top 0.254: IC4.26 31.25,48.25 36,53 R15.1
GND  (via drill 0.5)
  other vias: 49,25 42,25 35.5,41.5 29,44.5 26.5,39.5 35.5,38.5 32,31 117,25 15,100 117,81 4,88 3,26 70,80
  pour Top: 5,0 115,0 arc90 120,5 120,99 arc90 115,104 100,104 arc-90 97,107 arc90 94,110 26,110 arc90 23,107 arc-90 20,104 4,104 arc90 0,100 0,5 arc90
  pour Bottom: 26,110 arc90 23,107 arc-90 20,104 4,104 arc90 0,100 0,5 arc90 5,0 115,0 arc90 120,5 120,99 arc90 115,104 100,104 arc-90 97,107 arc90 94,110
  pour Route2: 0,0 0,110 120,110 120,0
ID_SCL  (via drill 0.5)
  Top 0.254: IC3.6 73.25,82.75 v74,82
  Top 0.305: R20.1 v87,82 86.64,82.36 IC2.6 | v74,82 75,82 76,81 76,78 70.2,72.2 70.2,69.54 MOD1.28
  Bottom 0.305: v74,82 75,82 v87,82
ID_SDA  (via drill 0.5)
  Top 0.254: IC3.5 71.75,82.25 v74,80
  Top 0.305: R19.1 v87,80 85.91,81.09 IC2.5 | MOD1.27 68.89,74.89 v74,80
  Bottom 0.305: v87,80 v74,80
IO2_SDA  (via drill 0.5)
  Top 0.305: J6.3 15.5,82.5 v16,82 | IC5.3 50.95,82.05 49,84 49,87 47,89 43,89 42.24,88.24 R5.1 41,87 40,86 40,84.93 IC6.1 36.91,84.91 36,84 36,79 38.41,76.59 MOD1.3
  Route2 0.305: v16,82 16,76 18,74 37,74 38.41,72.59 MOD1.3
IO3_SCL  (via drill 0.5)
  Top 0.305: IC5.1 52.05,83.95 v51,85 | J6.4 14.5,81.5 v18,78 | IC6.2 41,83.64 41.37,84 v43,84 43,81.52 42.24,80.76 R4.1 40.95,77.71 MOD1.5
  Route2 0.305: v18,78 20,76 39,76 40.95,74.05 MOD1.5
  Bottom 0.305: v43,84 50,84 v51,85
IO6_!BUTTON
  Top 0.305: SW1.P$1 30.76,7.06 R6.1
  Bottom 0.305: SW1.P$1 23,4 19,8 19,17 13,23 13,67 22,76 72,76 73.97,74.03 MOD1.31
IO12_LEDS
  Top 0.305: Q1.2 102.19,94.05 R2.1 99.24,94.24 94,89 94,80 86,72 86,68 85,67 75.2,67 MOD1.32
IO16_!CE2  (via drill 0.5)
  Top 0.305: SJ2.1 v11,55
  Route2 0.305: v11,55 18,55 28,65 78,65 79.05,66.05 MOD1.36
IO17_!ETH_RST  (via drill 0.5)
  Top 0.254: IC4.37 24.55,45.45 v22,48
  Top 0.305: v22,48 R1.1
  Bottom 0.305: v22,48 18,48 16,50 16,66 24,74 47,74 48.57,72.43 MOD1.11
IO18_!CE0  (via drill 0.5)
  Top 0.305: SJ1.1 15.24,62.24 19,66 v21,66
  Route2 0.305: MOD1.12 48.57,66.57 48,66 v21,66
IO19_CIPO1  (via drill 0.5)
  Top 0.254: IC4.34 27.25,47.96 26.71,48.5 v26,48.5
  Bottom 0.305: v26,48.5 26,59 32,65 76,65 77.8,66.8 77.8,69.52 MOD1.35
IO20_COPI1  (via drill 0.5)
  Top 0.254: IC4.35 26.75,44.75 v27.5,44
  Bottom 0.305: v27.5,44 27.5,58.5 33,64 80,64 81.59,65.59 MOD1.38
IO21_SCK1  (via drill 0.5)
  Top 0.254: IC4.33 27.75,48.1 25.85,50 v24.5,50
  Route2 0.305: v24.5,50 24.5,55.5 33,64 82,64 84.13,66.13 MOD1.40
IO25_!ETH_INT  (via drill 0.5)
  Top 0.254: IC4.36 25.55,46.45 22,50 R22.1 20.75,50.01
  Top 0.305: 20.75,50.01 v20.75,51.75
  Bottom 0.305: MOD1.22 61.27,67.27 60,66 31,66 20.75,55.75 v20.75,51.75
LEDS
  Top 0.305: Q1.3 106.86,95.76 R18.1 111.69,99.45 LED1.4-DIN
LINKLED  (via drill 0.5)
  Top 0.254: IC4.25 31.75,47.75 35,51 v37,51 R17.1
  Top 0.305: R13.2 35,19 v32,22
  Bottom 0.305: v32,22 32,27.5 37,32.5 v37,51
N$1
  Top 0.813: J3.2 68.27,3 96,3 98,5 D3.A
N$2
  Top 0.813: VR2.2 95.7,49.3 99.05,45.95 L1.1 107.15,45.95 D4.1
N$3
  Top 0.305: R13.1 35,10 36,9 36,5 37.58,3.42 J5.L4
N$4
  Top 0.305: R12.1 57,10 56,9 56,5 54.42,3.42 J5.L2
N$5  (via drill 0.5)
  Top 0.254: IC3.7 73.25,83.25 v74,84
  Top 0.305: R21.1 v87,84 86.64,83.64 IC2.7
  Route2 0.305: v87,84 91,88 J2.1
  Bottom 0.305: v87,84 v74,84
N$9  (via drill 0.5)
  Top 0.406: LED4.2-DOUT 115,8.2 v115,9 | v5,9 5,8.2 LED5.4-DIN
  Route15 0.305: v115,9 110,4 57.5,4 55,1.5 10.5,1.5 5,7 v5,9
N$10
  Top 0.305: LED5.2-DOUT 2.35,12.45 2.35,15.25 6.65,19.55 LED6.4-DIN
N$11
  Top 0.305: LED6.2-DOUT 2.35,42.45 2.35,45.25 6.65,49.55 LED7.4-DIN
N$12
  Top 0.305: LED7.2-DOUT 2.35,71.45 2.35,88.25 6.65,92.55 LED8.4-DIN
N$13
  Top 0.305: LED1.2-DOUT 117.65,93.55 117.65,90.75 113.35,86.45 LED2.4-DIN
N$14
  Top 0.305: LED2.2-DOUT 117.65,64.55 117.65,45.75 LED3.4-DIN
N$15
  Top 0.305: LED3.2-DOUT 117.65,35.55 117.65,32.75 113.35,28.45 LED4.4-DIN
N$16
  Top 0.254: R3.1 LED9.A
N$17
  Top 0.813: D2.A 91.15,8.85 87.3,12.7 J1.PWR
N$18
  Top 0.254: 24.64,54.1 C13.1 | 26.85,52.39 R31.1 27.24,50.76 28.75,49.25 IC4.31
  Top 0.305: 24.64,54.1 XTL1.3 26.85,52.39
N$19
  Top 0.813: D1.A 93.01,38.14 VR1.6
N$20
  Top 0.254: J5.4 44,16.98
  Top 0.305: R11.1 C10.1 R10.1 44,16.98
N$26
  Top 0.305: R16.2 LED12.C
N$27
  Top 0.254: 29.15,57.61 C12.1 | IC4.30 29.25,49.75 28.76,50.24 R31.2
  Top 0.305: 29.15,57.61 XTL1.1 30.1,55.9 31,55 31,53 30,52 R31.2
N$28
  Top 0.305: R17.2 LED13.C
N$31
  Top 0.254: IC4.20 35.49,42.75 37.24,41 C16.1
N$32
  Top 0.305: J5.9 50.45,18 51,18.55 R7.2 C15.1
N$33
  Top 0.254: IC4.10 30.75,36.25 31.5,35.5 32.5,35.5 33,35 R26.1
N$34
  Top 0.254: IC4.23 35.25,44.25 38,47 R23.1
N$36
  Top 0.254: RN1.1 20.8,38.8 22.75,40.75 IC4.45
N$37
  Top 0.254: RN1.2 20.6,39.6 22.25,41.25 IC4.44
N$38
  Top 0.254: RN1.3 20.4,40.4 21.75,41.75 IC4.43
N$39
  Top 0.254: RN1.4 20.2,41.2 21.25,42.25 IC4.42
N$40
  Top 0.254: IC4.41 19.73,42.75 RN2.1
N$41
  Top 0.254: IC4.40 21.75,43.25 21.4,43.6 RN2.2
N$42
  Top 0.254: IC4.39 22.25,43.75 21.6,44.4 RN2.3
N$43
  Top 0.254: IC4.38 22.75,44.25 21.8,45.2 RN2.4
N$327
  Top 0.305: R15.2 LED11.C
N$329
  Top 0.305: LED10.C R14.2
RXIN
  Top 0.254: IC4.5 28.25,30.75
  Top 0.305: 28.25,30.75 30.5,28.5 37.5,28.5 40,26 R11.2 39.24,23.76 38.5,23.02 38.5,20.5 39,20 42,20 42.83,19.18 J5.3
RXIP
  Top 0.254: IC4.6 28.75,31.75
  Top 0.305: 28.75,31.75 31,29.5 40.5,29.5 44,26 R10.2 44.74,23.76 45.37,23.14 J5.5
SPDLED
  Top 0.254: IC4.24 33.45,45.45 37,49 R16.1
TXON  (via drill 0.5)
  Top 0.254: IC4.1 26.25,36.55 25.25,35.55 25.25,30.75 32,24
  Top 0.305: 32,24 v34,24 | R9.1 47,19.07 J5.8
  Bottom 0.305: v34,24 38,20 48,20 49.17,18.82 J5.8
TXOP  (via drill 0.5)
  Top 0.254: IC4.2 26.75,36.05 25.75,35.05 25.75,31.25 31,26 v35,26
  Top 0.305: J5.10 53,18.18 R8.1
  Bottom 0.305: v35,26 40,21 50,21 51.72,19.29 J5.10
VA1
  Route2 0.813: J5.6 46.63,18.89 48.74,21 57,21 59.99,23.99 VR1.1
VA2
  Top 0.813: J5.1 40.28,12.35 41.13,11.5 50.5,11.5 62.53,23.53 VR1.2
VB1
  Bottom 0.813: J3.1 64.73,13.27 64,14 | J5.7 47.91,12.6 48.5,12 51,12 53,14 64,14 | VR1.3 65.07,15.07 64,14
VB2
  Top 0.813: J4.1 58.73,6.73 67.61,15.61 VR1.4
  Route2 0.813: J5.2 38.39,16.89 35,13.5 35,9 36,8 36,3 37.5,1.5 58.23,1.5 J4.1

### Text on the board
tPlace: IoT WiFi Access Point | by Jon Oxer | SuperHouse | www.superhouse.tv | Raspberry Pi Zero 2 / Inverted: flat PCB side up | !WE | GND | 3V3 | SDA | SCL | 1 | CE0 | CE2 | ACT | FDX | LNK | SPD | www.superhouse.tv/iotap | PoE Bypass | 12Vdc 1A | SKU: IOTAP v2.0
bPlace: (C) 2021-2022 SuperHouse Automation Pty Ltd / Released under the TAPR Open Hardware / License www.tapr.org/OHL
tValues: K | A | K | A | K | A